# Altium schematic sheet servo.SchDoc: servo
size 582 x 469 mm; Origin: Eagle; Date: 5/18/2023 8:33:32 AM; SheetNumber: 1; GateName_1: G$1; SymbolName_1: FRAME_C_L; LibraryName: frames; DeviceSetName: FRAME_C_L; GateName_2: G$2; SymbolName_2: DOCFIELD; Sheet: Sheet:; REV: REV:
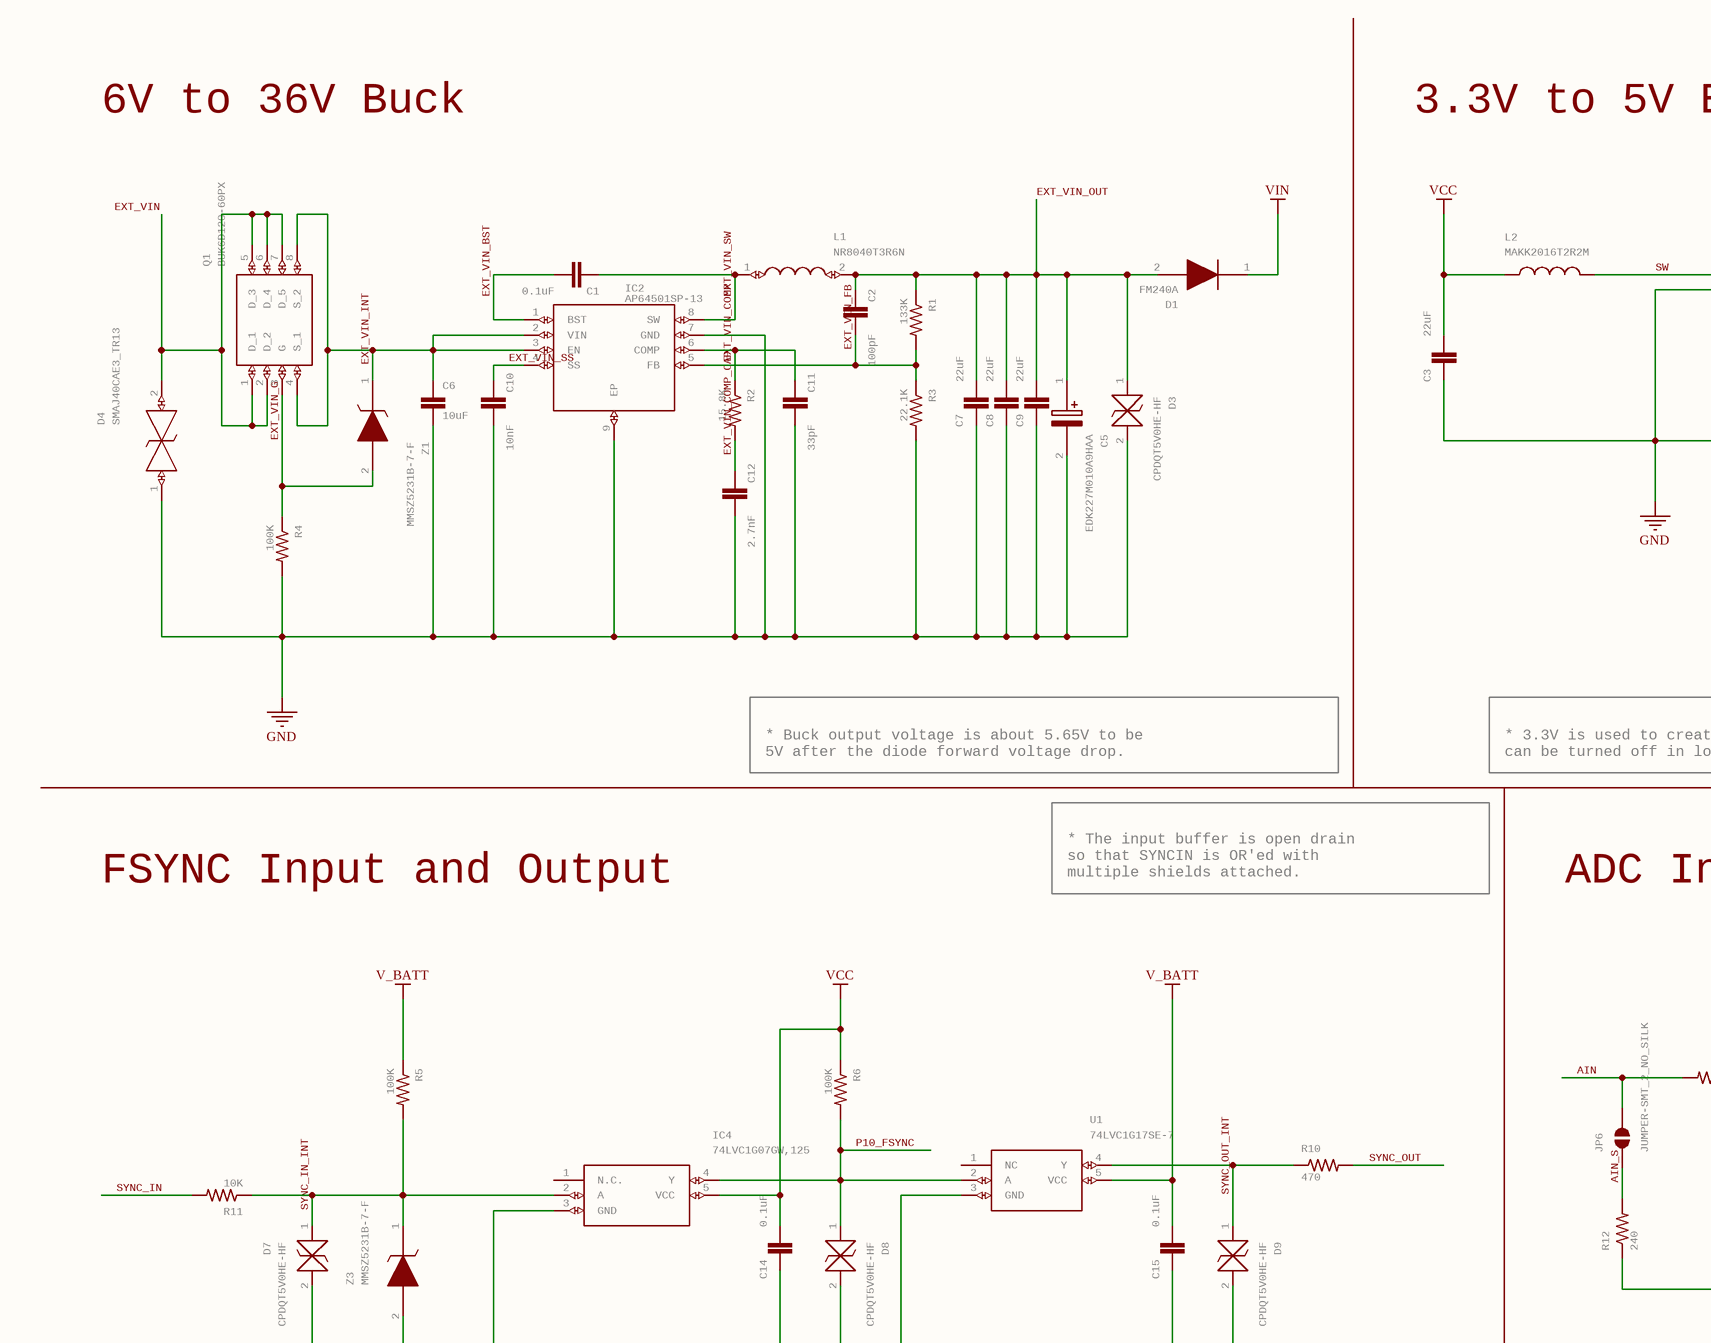
[diagram p0: servo.SchDoc, top left]
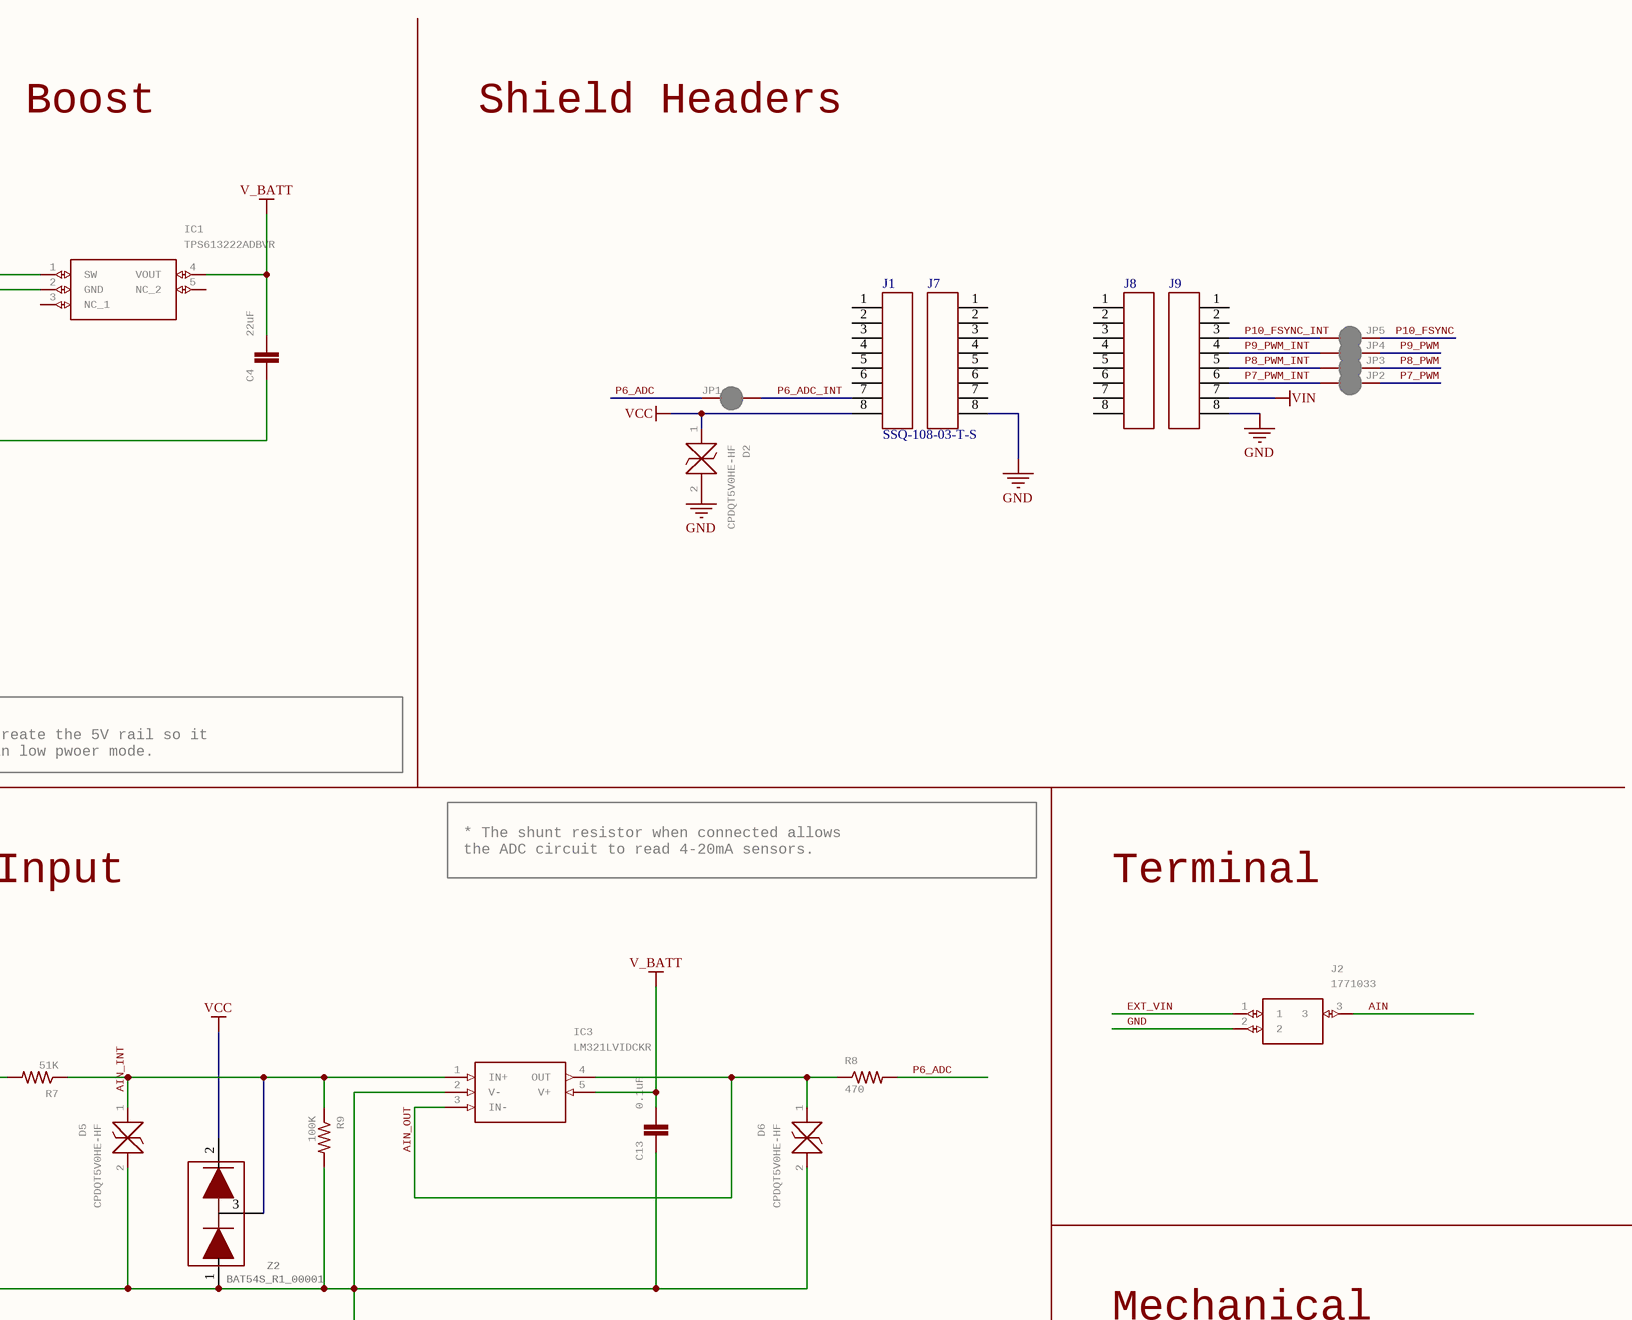
[diagram p1: servo.SchDoc, top right]
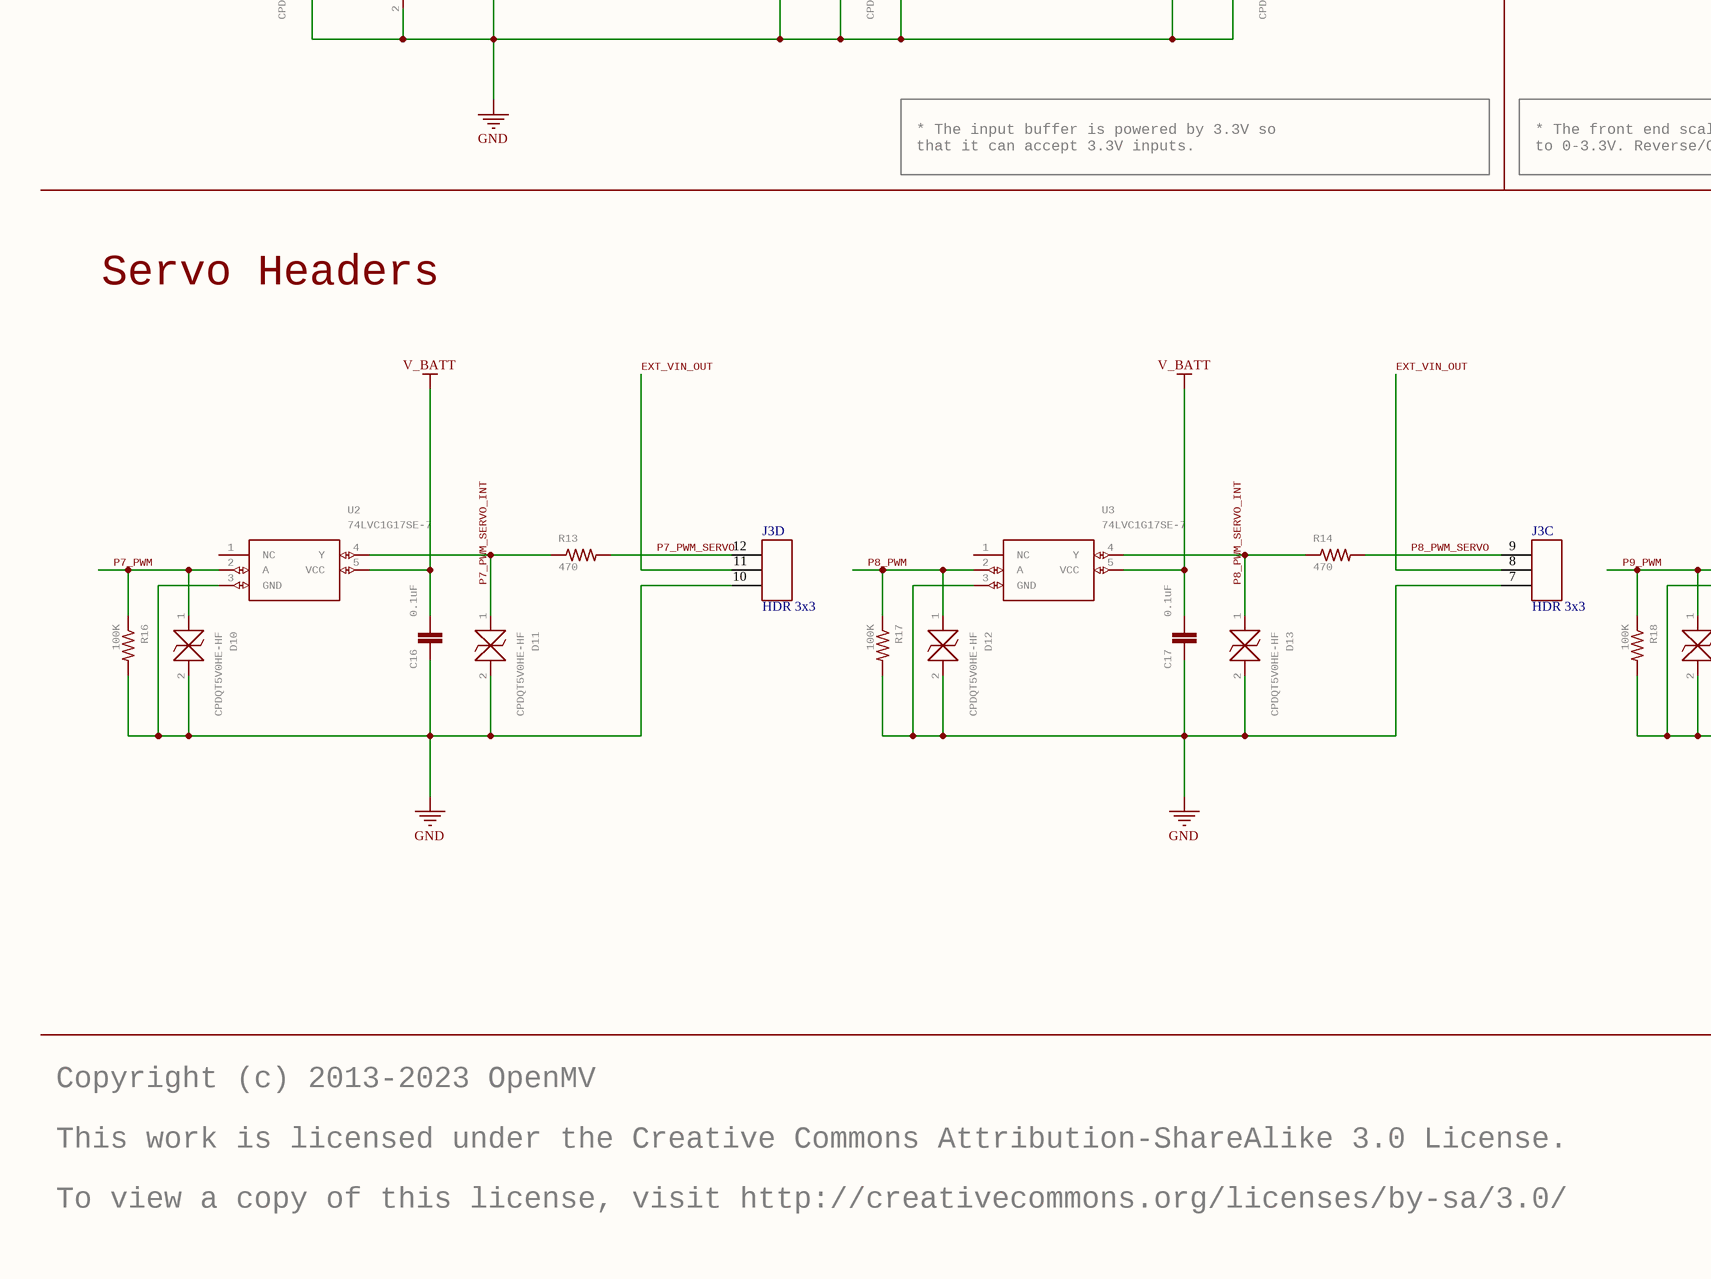
[diagram p2: servo.SchDoc, bottom left]
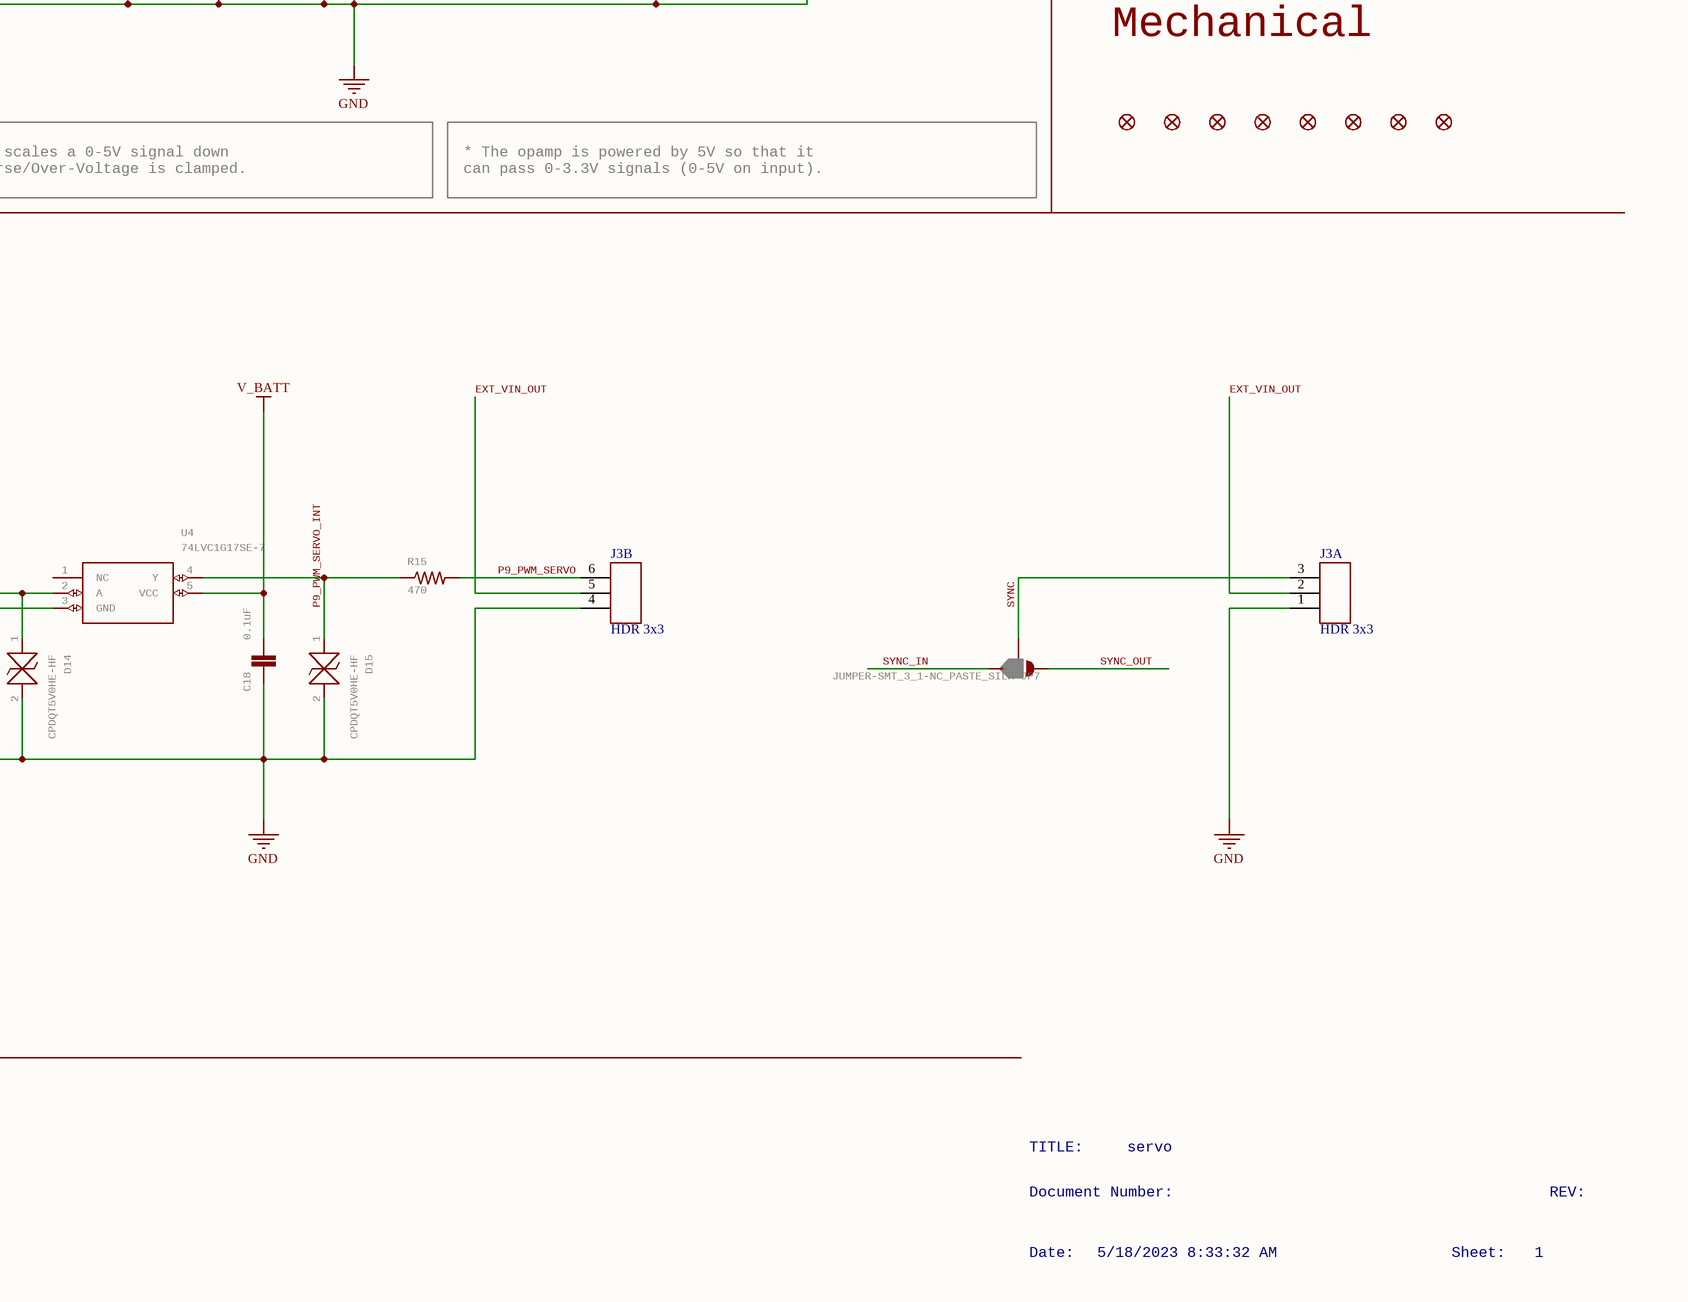
[diagram p3: servo.SchDoc, bottom right]

## Parts
C1  0.1uF  [0402-CAP]
C2  100pF  [0402-CAP]
C3  22uF  [0805-CAP]
C4  22uF  [0805-CAP]
C5  EDK227M010A9HAA  [CAPAE660X800N]
C6  10uF  [C0805]
C7  22uF  [0805-CAP]
C8  22uF  [0805-CAP]
C9  22uF  [0805-CAP]
C10  10nF  [0402-CAP]
C11  33pF  [0402-CAP]
C12  2.7nF  [0402-CAP]
C13  0.1uF  [0402-CAP]
C14  0.1uF  [0402-CAP]
C15  0.1uF  [0402-CAP]
C16  0.1uF  [0402-CAP]
C17  0.1uF  [0402-CAP]
C18  0.1uF  [0402-CAP]
D1  FM240A  [DIOM5025X231N]
D2  CPDQT5V0HE-HF  [CPDQT5V0HEHF]
D3  CPDQT5V0HE-HF  [CPDQT5V0HEHF]
D4  SMAJ40CAE3_TR13  [SMAJ40CAE3TR13]
D5  CPDQT5V0HE-HF  [CPDQT5V0HEHF]
D6  CPDQT5V0HE-HF  [CPDQT5V0HEHF]
D7  CPDQT5V0HE-HF  [CPDQT5V0HEHF]
D8  CPDQT5V0HE-HF  [CPDQT5V0HEHF]
D9  CPDQT5V0HE-HF  [CPDQT5V0HEHF]
D10  CPDQT5V0HE-HF  [CPDQT5V0HEHF]
D11  CPDQT5V0HE-HF  [CPDQT5V0HEHF]
D12  CPDQT5V0HE-HF  [CPDQT5V0HEHF]
D13  CPDQT5V0HE-HF  [CPDQT5V0HEHF]
D14  CPDQT5V0HE-HF  [CPDQT5V0HEHF]
D15  CPDQT5V0HE-HF  [CPDQT5V0HEHF]
FD1  FIDUCIAL1X2  [FIDUCIAL-1X2]  (value not drawn)
FD2  FIDUCIAL1X2  [FIDUCIAL-1X2]  (value not drawn)
FD3  FIDUCIAL1X2  [FIDUCIAL-1X2]  (value not drawn)
FD4  FIDUCIAL1X2  [FIDUCIAL-1X2]  (value not drawn)
FD5  FIDUCIAL1X2  [FIDUCIAL-1X2]  (value not drawn)
FD6  FIDUCIAL1X2  [FIDUCIAL-1X2]  (value not drawn)
FD7  FIDUCIAL1X2  [FIDUCIAL-1X2]  (value not drawn)
FD8  FIDUCIAL1X2  [FIDUCIAL-1X2]  (value not drawn)
IC1  TPS613222ADBVR  [SOT95P280X145-5N]
IC2  AP64501SP-13  [SOIC127P600X163-9N]
IC3  LM321LVIDCKR  [SOT65P210X110-5N]
IC4  74LVC1G07GW,125  [SOT65P212X110-5N]
J1  SSQ-108-03-T-S  [HDR_1X8]
J2  1771033  [1771033]
J3  HDR 3x3  [TSW-104-08-T-T-RA]  (parts A,B,C,D of 4)
J7  SSQ-108-03-T-S  [HDR_1X8]  (value not drawn)
J8  SSQ-108-03-T-S  [HDR_1X8]  (value not drawn)
J9  SSQ-108-03-T-S  [HDR_1X8]  (value not drawn)
JP1  JUMPER-SMT_2_NC_PASTE_SILK  [SMT-JUMPER_2_NC_PASTE_SILK]  (value not drawn)
JP2  JUMPER-SMT_2_NC_PASTE_SILK  [SMT-JUMPER_2_NC_PASTE_SILK]  (value not drawn)
JP3  JUMPER-SMT_2_NC_PASTE_SILK  [SMT-JUMPER_2_NC_PASTE_SILK]  (value not drawn)
JP4  JUMPER-SMT_2_NC_PASTE_SILK  [SMT-JUMPER_2_NC_PASTE_SILK]  (value not drawn)
JP5  JUMPER-SMT_2_NC_PASTE_SILK  [SMT-JUMPER_2_NC_PASTE_SILK]  (value not drawn)
JP6  JUMPER-SMT_2_NO_SILK  [SMT-JUMPER_2_NO_SILK]
JP7  JUMPER-SMT_3_1-NC_PASTE_SILK  [SMT-JUMPER_3_1-NC_PASTE_SILK]
L1  NR8040T3R6N  [NR8040T3R6N]
L2  MAKK2016T2R2M  [INDC2016X100N]
Q1  BUK6D120-60PX  [BUK6D12060PX]
R1  133K  [0402-RES]
R2  15.8K  [0402-RES]
R3  22.1K  [0402-RES]
R4  100K  [0402-RES]
R5  100K  [0402-RES]
R6  100K  [0402-RES]
R7  51K  [0402-RES]
R8  470  [R0603]
R9  100K  [0402]
R10  470  [R0603]
R11  10K  [0402-RES]
R12  240  [R0603]
R13  470  [R0603]
R14  470  [R0603]
R15  470  [R0603]
R16  100K  [0402-RES]
R17  100K  [0402-RES]
R18  100K  [0402-RES]
U1  74LVC1G17SE-7  [SOT65P210X110-5N]
U2  74LVC1G17SE-7  [SOT65P210X110-5N]
U3  74LVC1G17SE-7  [SOT65P210X110-5N]
U4  74LVC1G17SE-7  [SOT65P210X110-5N]
Z1  MMSZ5231B-7-F  [SOD3716X145N]
Z2  BAT54S_R1_00001  [SOT23-3]
Z3  MMSZ5231B-7-F  [SOD3716X145N]

## Nets
GND: C3.1 C4.1 C5.2(-) C6.2 C7.1 C8.1 C9.1 C10.2 C11.2 C12.2 C13.1 C14.1 C15.1 C16.1 C17.1 C18.1 D2.2 D3.2 D4.1 D5.2 D6.2 D7.2 D8.2 D9.2 D10.2 D11.2 D12.2 D13.2 D14.2 D15.2 IC1.2(GND) IC2.7(GND) IC2.9(EP) IC3.2(V-) IC4.3(GND) J2.2 J3.1 J3.4 J3.7 J3.10 J7.8 J9.8 R3.2 R4.2 R9.2 R12.1 R16.2 R17.2 R18.2 U1.3(GND) U2.3(GND) U3.3(GND) U4.3(GND) Z2.1 Z3.2(A)
V_BATT: C4.2 C13.2 C15.2 C16.2 C17.2 C18.2 IC1.4(VOUT) IC3.5(V+) R5.1 U1.5(VCC) U2.5(VCC) U3.5(VCC) U4.5(VCC)
VCC: C3.2 C14.2 D2.1 IC4.5(VCC) J1.8 L2.1 R6.1 Z2.2
VIN: D1.1(K) J9.7
AIN: J2.3 JP6.2 R7.2
AIN_INT: D5.1 IC3.1(IN+) R7.1 R9.1 Z2.3
AIN_OUT: D6.1 IC3.3(IN-) IC3.4(OUT) R8.1
AIN_S: JP6.1 R12.2
EXT_VIN: D4.2 J2.1 Q1.1(D_1) Q1.2(D_2) Q1.5(D_3) Q1.6(D_4) Q1.7(D_5)
EXT_VIN_BST: C1.2 IC2.1(BST)
EXT_VIN_COMP: C11.1 IC2.6(COMP) R2.1
EXT_VIN_COMP_CAP: C12.1 R2.2
EXT_VIN_FB: C2.2 IC2.5(FB) R1.2 R3.1
EXT_VIN_G: Q1.3(G) R4.1 Z1.2(A)
EXT_VIN_INT: C6.1 IC2.2(VIN) IC2.3(EN) Q1.4(S_1) Q1.8(S_2) Z1.1(K)
EXT_VIN_OUT: C2.1 C5.1(+) C7.2 C8.2 C9.2 D1.2(A) D3.1 J3.2 J3.5 J3.8 J3.11 L1.2 R1.1
EXT_VIN_SS: C10.1 IC2.4(SS)
EXT_VIN_SW: C1.1 IC2.8(SW) L1.1
P6_ADC: JP1.2 R8.2
P6_ADC_INT: J1.7 JP1.1
P7_PWM: D10.1 JP2.2 R16.1 U2.2(A)
P7_PWM_INT: J9.6 JP2.1
P7_PWM_SERVO: J3.12 R13.2
P7_PWM_SERVO_INT: D11.1 R13.1 U2.4(Y)
P8_PWM: D12.1 JP3.2 R17.1 U3.2(A)
P8_PWM_INT: J9.5 JP3.1
P8_PWM_SERVO: J3.9 R14.2
P8_PWM_SERVO_INT: D13.1 R14.1 U3.4(Y)
P9_PWM: D14.1 JP4.2 R18.1 U4.2(A)
P9_PWM_INT: J9.4 JP4.1
P9_PWM_SERVO: J3.6 R15.2
P9_PWM_SERVO_INT: D15.1 R15.1 U4.4(Y)
P10_FSYNC: D8.1 IC4.4(Y) JP5.2 R6.2 U1.2(A)
P10_FSYNC_INT: J9.3 JP5.1
SW: IC1.1(SW) L2.2
SYNC: J3.3 JP7.2
SYNC_IN: JP7.3 R11.2
SYNC_IN_INT: D7.1 IC4.2(A) R5.2 R11.1 Z3.1(K)
SYNC_OUT: JP7.1 R10.2
SYNC_OUT_INT: D9.1 R10.1 U1.4(Y)

Not connected (* = marked no-connect by the designer): IC1 3(NC_1) 5(NC_2); IC4 1(N.C.); J1 1 2 3 4 5 6; J7 1 2 3 4 5 6 7; J8 1 2 3 4 5 6 7 8; J9 1 2; U1 1(NC); U2 1(NC); U3 1(NC); U4 1(NC)

## Notes on the sheet
- 6V to 36V Buck
- 3.3V to 5V Boost
- Shield Headers
- * Buck output voltage is about 5.65V to be
  5V after the diode forward voltage drop.
- * 3.3V is used to create the 5V rail so it
  can be turned off in low pwoer mode.
- * The shunt resistor when connected allows
  the ADC circuit to read 4-20mA sensors.
- FSYNC Input and Output
- * The input buffer is open drain
  so that SYNCIN is OR'ed with
  multiple shields attached.
- ADC Input
- Terminal
- Mechanical
- * The input buffer is powered by 3.3V so
  that it can accept 3.3V inputs.
- * The front end scales a 0-5V signal down
  to 0-3.3V. Reverse/Over-Voltage is clamped.
- * The opamp is powered by 5V so that it
  can pass 0-3.3V signals (0-5V on input).
- Servo Headers
- Copyright (c) 2013-2023 OpenMV
- TITLE:
- servo
- This work is licensed under the Creative Commons Attribution-ShareAlike 3.0 License.
- To view a copy of this license, visit http://creativecommons.org/licenses/by-sa/3.0/
- Document Number:
- REV:
- Date:
- 5/18/2023 8:33:32 AM
- Sheet:
- 1

## Library data of the parts
C1 C13-C18 = CAP_0402: 0402 (1005 Metric) Nick Garner - TeleSense; MPN: GRM155R71H104KE14D; GateName_1: G$1; SymbolName_1: CAP; LibraryName: 0402; DeviceSetName: CAP_0402
C2 = CAP_0402: 0402 (1005 Metric) Nick Garner - TeleSense; MPN: CC0402JRNPO9BN101; GateName_1: G$1; SymbolName_1: CAP; LibraryName: 0402; DeviceSetName: CAP_0402
C3 C4 C7-C9 = 22UF-0805-6.3V-20%: 22ÂµF ceramic capacitors    A capacitor is a passive two-terminal electrical component used to store electrical energy temporarily in an electric field.; MPN: CL21A226MQQNNNE; GateName_1: G$1; SymbolName_1: CAP; PROD_ID: CAP-08402; DeviceName: -0805-6.3V-20%; LibraryName: SparkFun-Capacitors; DeviceSetName: 22UF
C5 = EDK227M010A9HAA: EDK, Aluminum, Aluminum Electrolytic, 220 uF, 20%, 10 VDC, -40/+85C, 85C, -40C, 85C, 2,000 Hrs, 26 % , 0.25, 22 uA, 3, 6, 6.3mm, 7.7mm, 1000   Source:  Datasheet; MANUFACTURER_NAME: KEMET; GateName_1: G$1; SymbolName_1: EDK227M010A9HAA; LibraryName: EDK227M010A9HAA; DeviceSetName: EDK227M010A9HAA; HEIGHT: 8mm; MANUFACTURER_PART_NUMBER: EDK227M010A9HAA; MOUSER_PART_NUMBER: 80-EDK227M010A9HAA; MOUSER_PRICE-STOCK: https://www.mouser.co.uk/ProductDetail/KEMET/EDK227M010A9HAA?qs=E9QF1UCAUX64XuBtcKp6BA%3D%3D; MPN: EDK227M010A9HAA
C6 = C-EUC0805: CAPACITOR, European symbol; MPN: GRM21BR61H106KE43K; GateName_1: G$1; SymbolName_1: C-EU; POPULARITY: 88; DeviceName: C0805; LibraryName: rcl; DeviceSetName: C-EU; SPICEPREFIX: C
C10 = CAP_0402: 0402 (1005 Metric) Nick Garner - TeleSense; MPN: CL05B103KB5NNNC; GateName_1: G$1; SymbolName_1: CAP; LibraryName: 0402; DeviceSetName: CAP_0402
C11 = CAP_0402: 0402 (1005 Metric) Nick Garner - TeleSense; MPN: 04025A330JAT2A; GateName_1: G$1; SymbolName_1: CAP; LibraryName: 0402; DeviceSetName: CAP_0402
C12 = CAP_0402: 0402 (1005 Metric) Nick Garner - TeleSense; MPN: GCM155R71H272KA37J; GateName_1: G$1; SymbolName_1: CAP; LibraryName: 0402; DeviceSetName: CAP_0402
D1 = FM240A: Diodes - General Purpose, Power, Switching GP Si Rectifier SMB,2A,40V   Source:  Datasheet; MANUFACTURER_NAME: Rectron; GateName_1: G$1; SymbolName_1: FM240A; LibraryName: FM240A; DeviceSetName: FM240A; HEIGHT: 2.31mm; MANUFACTURER_PART_NUMBER: FM240A; MOUSER_PART_NUMBER: 583-FM240A; MOUSER_PRICE-STOCK: https://www.mouser.co.uk/ProductDetail/Rectron/FM240A?qs=7pEAo90IqNG7sknZwmLYhQ%3D%3D; MPN: FM240A
D2 D3 D5-D15 = CPDQT5V0HE-HF: ESD Suppressors / TVS Diodes DIODE ESD 5VWM 65W 0402/SOD-923F   Source:  Datasheet; MANUFACTURER_NAME: Comchip Technology; GateName_1: G$1; SymbolName_1: CPDQT5V0HE-HF; LibraryName: CPDQT5V0HE-HF; DeviceSetName: CPDQT5V0HE-HF; HEIGHT: 0.42mm; MANUFACTURER_PART_NUMBER: CPDQT5V0HE-HF; MOUSER_PART_NUMBER: MOUSER_PART_NUMBER; MOUSER_PRICE-STOCK: MOUSER_PRICE-STOCK; MPN: CPDQT5V0HE-HF
D4 = SMAJ40CAE3_TR13: ESD Suppressors / TVS Diodes TVS   Source:  Datasheet; MANUFACTURER_NAME: Microchip; MANUFACTURER_PART_NUMBER: SMAJ40CAe3/TR13; GateName_1: G$1; SymbolName_1: SMAJ40CAE3_TR13; LibraryName: SMAJ40CAe3_TR13; DeviceSetName: SMAJ40CAE3_TR13; HEIGHT: 3.05mm; MOUSER_PART_NUMBER: 494-SMAJ40CAE3/TR13; MOUSER_PRICE-STOCK: https://www.mouser.co.uk/ProductDetail/Microchip-Technology/SMAJ40CAe3-TR13?qs=pU29NIZ4ZwCw3PnlxOleOw%3D%3D; MPN: SMAJ40CAe3/TR13
FD1-FD8 = FIDUCIAL1X2: Fiducial Alignment Points    Point-of-reference for pick-and-place machines and other optical instruments.; GateName_1: G$1; DeviceName: 1X2; SymbolName_1: FIDUCIAL; LibraryName: SparkFun-Aesthetics; DeviceSetName: FIDUCIAL
IC1 = TPS613222ADBVR: 6-uA Quiescent Current, 1.8-A Switch Current Boost Converter   Source:  Datasheet; MANUFACTURER_NAME: Texas Instruments; GateName_1: G$1; SymbolName_1: TPS613222ADBVR; LibraryName: TPS613222ADBVR; DeviceSetName: TPS613222ADBVR; HEIGHT: 1.45mm; MANUFACTURER_PART_NUMBER: TPS613222ADBVR; MOUSER_PART_NUMBER: 595-TPS613222ADBVR; MOUSER_PRICE-STOCK: https://www.mouser.co.uk/ProductDetail/Texas-Instruments/TPS613222ADBVR?qs=W0yvOO0ixfE4d69WXsn8NQ%3D%3D; MPN: TPS613222ADBVR
IC2 = AP64501SP-13: Conv DC-DC 3.8V to 40V Synchronous Step Down Single-Out 0.8V to 39V 5A 8-Pin SO EP T/R   Source:  Datasheet; MANUFACTURER_NAME: Diodes Inc.; GateName_1: G$1; SymbolName_1: AP64501SP-13; LibraryName: AP64501SP-13; DeviceSetName: AP64501SP-13; HEIGHT: 1.63mm; MANUFACTURER_PART_NUMBER: AP64501SP-13; MOUSER_PART_NUMBER: 621-AP64501SP-13; MOUSER_PRICE-STOCK: https://www.mouser.co.uk/ProductDetail/Diodes-Incorporated/AP64501SP-13?qs=P1JMDcb91o7FS0GU%252BW7TIQ%3D%3D; MPN: AP64501SP-13
IC3 = LM321LVIDCKR: 1-Channel industry standard low voltage operational amplifier   Source:  Datasheet; MANUFACTURER_NAME: Texas Instruments; GateName_1: G$1; SymbolName_1: LM321LVIDCKR; LibraryName: LM321LVIDCKR; DeviceSetName: LM321LVIDCKR; HEIGHT: 1.1mm; MANUFACTURER_PART_NUMBER: LM321LVIDCKR; MOUSER_PART_NUMBER: 595-LM321LVIDCKR; MOUSER_PRICE-STOCK: https://www.mouser.co.uk/ProductDetail/Texas-Instruments/LM321LVIDCKR?qs=qSfuJ%252Bfl%2Fd6RcyTOjkRx5Q%3D%3D; MPN: LM321LVIDCKR
IC4 = 74LVC1G07GW,125: 74LVC1G07 - Buffer with open-drain output@en-us   Source:  Datasheet; MANUFACTURER_NAME: Nexperia; GateName_1: G$1; SymbolName_1: 74LVC1G07GW,125; LibraryName: 74LVC1G07GW_125; DeviceSetName: 74LVC1G07GW,125; HEIGHT: 1.1mm; MANUFACTURER_PART_NUMBER: 74LVC1G07GW,125; MOUSER_PART_NUMBER: 771-74LVC1G07GW-G; MOUSER_PRICE-STOCK: https://www.mouser.co.uk/ProductDetail/Nexperia/74LVC1G07GW125?qs=me8TqzrmIYW763Mg%2FG86Uw%3D%3D; MPN: 74LVC1G07GW,125
J1 J7-J9 = HDR_1X8: MANUFACTURER P/N: SSQ-108-03-T-S
J2 = 1771033: PCB terminal block, nominal current: 6 A, rated voltage (III/2): 160 V, nominal cross section: 0.5 mm?, Number of potentials: 3, Number of rows: 1, Number of positions per row: 3, product range: PTSM 0,5/..-H-SMD, pitch: 2.5 mm, connection method: Push-in spring connection, mounting: SMD soldering, conductor/PCB connection direction: 0 ?, color: black, Pin layout: Linear pad geometry, type of packaging: packed in cardboard   Source:  Datasheet; MANUFACTURER_NAME: Phoenix Contact; GateName_1: G$1; SymbolName_1: 1771033; LibraryName: 1771033; DeviceSetName: 1771033; ARROW_PART_NUMBER: 1771033; ARROW_PRICE-STOCK: https://www.arrow.com/en/products/1771033/phoenix-contact?region=nac; HEIGHT: 5.22mm; MANUFACTURER_PART_NUMBER: 1771033; MOUSER_PART_NUMBER: 651-1771033; MOUSER_PRICE-STOCK: https://www.mouser.co.uk/ProductDetail/Phoenix-Contact/1771033?qs=Q77YN%2FRrsKK5q5FqaCIZZA%3D%3D; MPN: 1771033
J3 = TSW-104-08-T-T-RA
JP1-JP5 = JUMPER-SMT_2_NC_PASTE_SILK: Normally closed solder jumper    This jumper has an aperture in the stencil to allow solder paste to bridge the split in the wire so it's normally closed (NC). Wick off the solder to open the connection. Reapply solder to reclose the connection.; GateName_1: G$1; SymbolName_1: SMT-JUMPER_2_NC_PASTE; DeviceName: _SILK; LibraryName: SparkFun-Jumpers; DeviceSetName: JUMPER-SMT_2_NC_PASTE
JP6 = JUMPER-SMT_2_NO_SILK: Normally open jumper    This jumper has two pads in close proximity to each other. Apply solder to close the connection.   Round pads are easier to solder for beginners, but are a lot larger.   SparkFun Product that uses the round pads:  SparkFun EL Sequencer; GateName_1: G$1; SymbolName_1: SMT-JUMPER_2_NO; DeviceName: _SILK; LibraryName: SparkFun-Jumpers; DeviceSetName: JUMPER-SMT_2_NO
JP7 = JUMPER-SMT_3_1-NC_PASTE_SILK: Normally closed solder jumper (1 of 2 connections)    This jumper has an aperture in the stencil to allow solder paste to bridge one of the two connections. One connection is normally closed (NC), while the other is normally open (NO). Wick off the solder to open the connection. Reapply solder to reclose the connection. Apply solder to the other side instead to change the current path.; GateName_1: G$1; SymbolName_1: SMT-JUMPER_3_1-NC_PASTE; DeviceName: _SILK; LibraryName: SparkFun-Jumpers; DeviceSetName: JUMPER-SMT_3_1-NC_PASTE
L1 = NR8040T3R6N: NR8040T3R6N   Source:  Datasheet; MANUFACTURER_NAME: TAIYO YUDEN; MPN: NRS8040T3R6NJGJ; GateName_1: G$1; SymbolName_1: NR8040T3R6N; LibraryName: NR8040T3R6N; DeviceSetName: NR8040T3R6N; HEIGHT: 4.2mm; MANUFACTURER_PART_NUMBER: NR8040T3R6N; MOUSER_PART_NUMBER: 963-NR8040T3R6N; MOUSER_PRICE-STOCK: https://www.mouser.co.uk/ProductDetail/Taiyo-Yuden/NR8040T3R6N?qs=PzICbMaShUfIZ5Ej1bVWkg%3D%3D
L2 = MAKK2016T2R2M: INDUCTOR, METAL CORE Check availability; GateName_1: G$1; MF: Taiyo Yuden; SymbolName_1: MAKK2016T2R2M; LibraryName: MAKK2016T2R2M; DeviceSetName: MAKK2016T2R2M; AVAILABILITY: In Stock; MP: MAKK2016T2R2M; MPN: MAKK2016T2R2M; PACKAGE: 2016 Taiyo Yuden; PRICE: None; PURCHASE-URL: https://pricing.snapeda.com/search/part/MAKK2016T2R2M/?ref=eda
Q1 = BUK6D120-60PX: MOSFET 60V P-CH TRENCHMOS SOT1220   Source:  Datasheet; MANUFACTURER_NAME: Nexperia; GateName_1: G$1; SymbolName_1: BUK6D120-60PX; LibraryName: BUK6D120-60PX; DeviceSetName: BUK6D120-60PX; HEIGHT: 0.65mm; MANUFACTURER_PART_NUMBER: BUK6D120-60PX; MOUSER_PART_NUMBER: 771-BUK6D120-60PX; MOUSER_PRICE-STOCK: https://www.mouser.co.uk/ProductDetail/Nexperia/BUK6D120-60PX?qs=F5EMLAvA7IBtoNC2L3hOcQ%3D%3D; MPN: BUK6D120-60PX
R1 = RES_0402: 0402 (1005 Metric) Nick Garner - TeleSense; MPN: RC0402FR-07133KL; GateName_1: G$1; SymbolName_1: RESISTOR; LibraryName: 0402; DeviceSetName: RES_0402
R2 = RES_0402: 0402 (1005 Metric) Nick Garner - TeleSense; MPN: AC0402FR-0715K8L; GateName_1: G$1; SymbolName_1: RESISTOR; LibraryName: 0402; DeviceSetName: RES_0402
R3 = RES_0402: 0402 (1005 Metric) Nick Garner - TeleSense; MPN: CR0402-FX-2212GLF; GateName_1: G$1; SymbolName_1: RESISTOR; LibraryName: 0402; DeviceSetName: RES_0402
R4-R6 R9 R16-R18 = RES_0402: 0402 (1005 Metric) Nick Garner - TeleSense; MPN: AC0402FR-07100KL; GateName_1: G$1; SymbolName_1: RESISTOR; LibraryName: 0402; DeviceSetName: RES_0402
R7 = RES_0402: 0402 (1005 Metric) Nick Garner - TeleSense; MPN: RC0402JR-0751KL; GateName_1: G$1; SymbolName_1: RESISTOR; LibraryName: 0402; DeviceSetName: RES_0402
R8 R10 R13-R15 = R-US_R0603: RESISTOR, American symbol; MPN: CR0603-FX-4700ELF; GateName_1: G$1; SymbolName_1: R-US; DeviceSetName: R-US_; POPULARITY: 77; DeviceName: R0603; LibraryName: rcl; SPICEPREFIX: R
R11 = RES_0402: 0402 (1005 Metric) Nick Garner - TeleSense; MPN: AC0402FR-1310KL; GateName_1: G$1; SymbolName_1: RESISTOR; LibraryName: 0402; DeviceSetName: RES_0402
R12 = R-US_R0603: RESISTOR, American symbol; MPN: RK73B1JTTD241J; GateName_1: G$1; SymbolName_1: R-US; DeviceSetName: R-US_; POPULARITY: 77; DeviceName: R0603; LibraryName: rcl; SPICEPREFIX: R
U1-U4 = 74LVC1G17SE-7: DiodesZetex 74LVC1G17SE-7, Buffer, Push-Pull, Non-Inverting, 1.65  5.5 V, 5-Pin SOT-353   Source:  Datasheet; MANUFACTURER_NAME: Diodes Inc.; GateName_1: G$1; SymbolName_1: 74LVC1G17SE-7; LibraryName: 74LVC1G17SE-7; DeviceSetName: 74LVC1G17SE-7; HEIGHT: 1.1mm; MANUFACTURER_PART_NUMBER: 74LVC1G17SE-7; MOUSER_PART_NUMBER: 621-74LVC1G17SE-7; MOUSER_PRICE-STOCK: https://www.mouser.co.uk/ProductDetail/Diodes-Incorporated/74LVC1G17SE-7?qs=FRHfhEBFk1dzIcstjqNcyA%3D%3D; MPN: 74LVC1G17SE-7
Z1 Z3 = MMSZ5231B-7-F: Zener Diode 5.1V 5% 500mW SOD123 Diodes Inc MMSZ5231B-7-F Zener Diode, 5.1V 5% 0.5 W SMT 2-Pin SOD-123   Source:  Datasheet; MANUFACTURER_NAME: Diodes Inc.; GateName_1: G$1; SymbolName_1: MMSZ5231B-7-F; LibraryName: MMSZ5231B-7-F; DeviceSetName: MMSZ5231B-7-F; HEIGHT: 1.45mm; MANUFACTURER_PART_NUMBER: MMSZ5231B-7-F; MOUSER_PART_NUMBER: 621-MMSZ5231B-F; MOUSER_PRICE-STOCK: https://www.mouser.co.uk/ProductDetail/Diodes-Incorporated/MMSZ5231B-7-F?qs=2ygBApjwyeMh7Sf0YL1qSw%3D%3D; MPN: MMSZ5231B-7-F